# Altium schematic sheet Sheet2.SchDoc
size 420 x 297 mm; Scale: 1:1; DocumentType: Схема электрическая принципиальная; FirstReferrence: АБВГ.123456.001
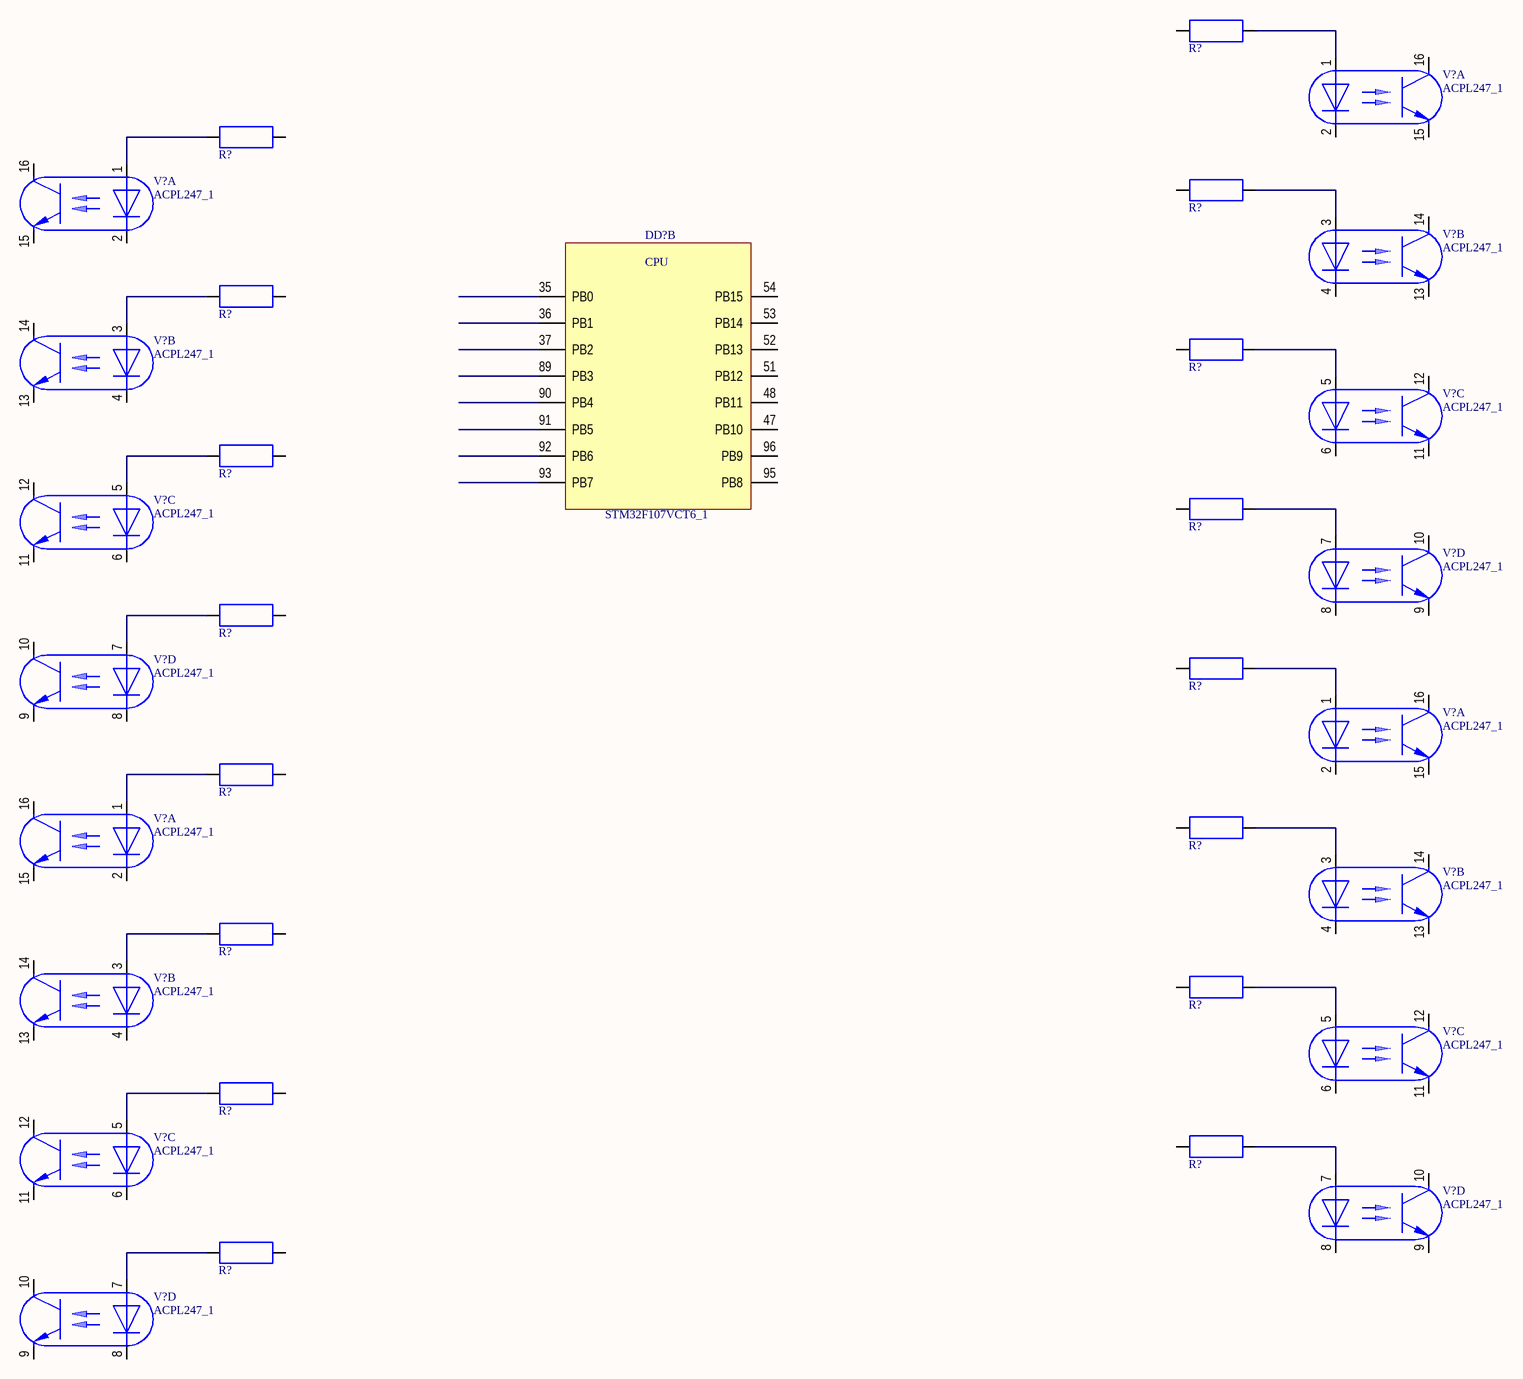
[diagram p0: Sheet2.SchDoc]

## Parts
(Parts that share a designator on the sheet are numbered #1, #2 ... from top to bottom, then left to right.)
DD?  STM32F107VCT6_1  [LQFP100_N]  (part B of 6)
R?#1  R_1  (value not drawn)
R?#2  R_1  (value not drawn)
R?#3  R_1  (value not drawn)
R?#4  R_1  (value not drawn)
R?#5  R_1  (value not drawn)
R?#6  R_1  (value not drawn)
R?#7  R_1  (value not drawn)
R?#8  R_1  (value not drawn)
R?#9  R_1  (value not drawn)
R?#10  R_1  (value not drawn)
R?#11  R_1  (value not drawn)
R?#12  R_1  (value not drawn)
R?#13  R_1  (value not drawn)
R?#14  R_1  (value not drawn)
R?#15  R_1  (value not drawn)
R?#16  R_1  (value not drawn)
V?#1  ACPL247_1  [SOP127P700X220-16N]  (part A of 4)
V?#2  ACPL247_1  [SOP127P700X220-16N]  (part A of 4)
V?#3  ACPL247_1  [SOP127P700X220-16N]  (part B of 4)
V?#4  ACPL247_1  [SOP127P700X220-16N]  (part B of 4)
V?#5  ACPL247_1  [SOP127P700X220-16N]  (part C of 4)
V?#6  ACPL247_1  [SOP127P700X220-16N]  (part C of 4)
V?#7  ACPL247_1  [SOP127P700X220-16N]  (part D of 4)
V?#8  ACPL247_1  [SOP127P700X220-16N]  (part D of 4)
V?#9  ACPL247_1  [SOP127P700X220-16N]  (part A of 4)
V?#10  ACPL247_1  [SOP127P700X220-16N]  (part A of 4)
V?#11  ACPL247_1  [SOP127P700X220-16N]  (part B of 4)
V?#12  ACPL247_1  [SOP127P700X220-16N]  (part B of 4)
V?#13  ACPL247_1  [SOP127P700X220-16N]  (part C of 4)
V?#14  ACPL247_1  [SOP127P700X220-16N]  (part C of 4)
V?#15  ACPL247_1  [SOP127P700X220-16N]  (part D of 4)
V?#16  ACPL247_1  [SOP127P700X220-16N]  (part D of 4)

## Nets
NetR?#1_1: R?#1.1 V?#1.1
NetR?#2_1: R?#2.1 V?#2.1
NetR?#3_1: R?#3.1 V?#3.3
NetR?#4_1: R?#4.1 V?#4.3
NetR?#5_1: R?#5.1 V?#5.5
NetR?#6_1: R?#6.1 V?#6.5
NetR?#7_1: R?#7.1 V?#7.7
NetR?#8_1: R?#8.1 V?#8.7
NetR?#9_1: R?#9.1 V?#9.1
NetR?#10_1: R?#10.1 V?#10.1
NetR?#11_1: R?#11.1 V?#11.3
NetR?#12_1: R?#12.1 V?#12.3
NetR?#13_1: R?#13.1 V?#13.5
NetR?#14_1: R?#14.1 V?#14.5
NetR?#15_1: R?#15.1 V?#15.7
NetR?#16_1: R?#16.1 V?#16.7

Not connected (* = marked no-connect by the designer): DD? 35(PB0) 36(PB1) 37(PB2) 47(PB10) 48(PB11) 51(PB12) 52(PB13) 53(PB14) 54(PB15) 89(PB3) 90(PB4) 91(PB5) 92(PB6) 93(PB7) 95(PB8) 96(PB9); R?#1 2; R?#2 2; R?#3 2; R?#4 2; R?#5 2; R?#6 2; R?#7 2; R?#8 2; R?#9 2; R?#10 2; R?#11 2; R?#12 2; R?#13 2; R?#14 2; R?#15 2; R?#16 2; V?#1 2 15 16; V?#2 2 15 16; V?#3 4 13 14; V?#4 4 13 14; V?#5 6 11 12; V?#6 6 11 12; V?#7 8 9 10; V?#8 8 9 10; V?#9 2 15 16; V?#10 2 15 16; V?#11 4 13 14; V?#12 4 13 14; V?#13 6 11 12; V?#14 6 11 12; V?#15 8 9 10; V?#16 8 9 10

## Notes on the sheet
- Подп. и дата
- Инв. № дубл.
- Взам. инв. №
- Инв. № подл.
- Изм.
- Лист
- № докум.
- Подп.
- Дата
- 2.106-A3
- Копировал
- Формат А3
- (in symbol STM32F107VCT6_1, part B) CPU